# Altium schematic sheet USB3.1C16PFSMT_2021-08-31.schdoc
size 54 x 65 mm
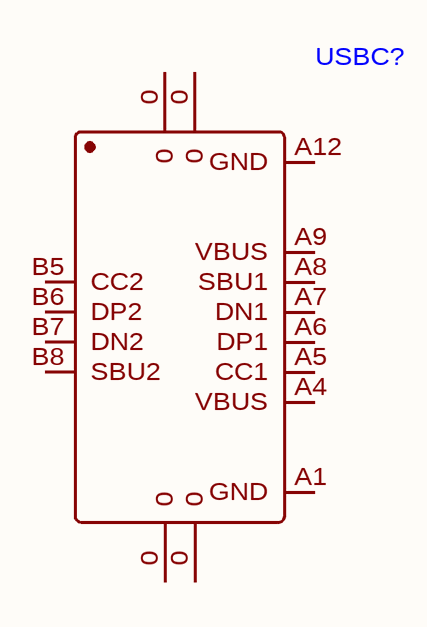
[diagram p0: USB3.1C16PFSMT_2021-08-31.schdoc]

## Parts
USBC?  (no value)  [USB-C-SMD_TYPE-C-USB-17]

## Nets

Not connected (* = marked no-connect by the designer): USBC? 0 A1(GND) A4(VBUS) A5(CC1) A6(DP1) A7(DN1) A8(SBU1) A9(VBUS) A12(GND) B5(CC2) B6(DP2) B7(DN2) B8(SBU2)

## Library data of the parts
USBC? = USB3.1C16PFSMT